# EAGLE design SNES_RGBAmp_1Chip03+ (EAGLE 7.5.0)
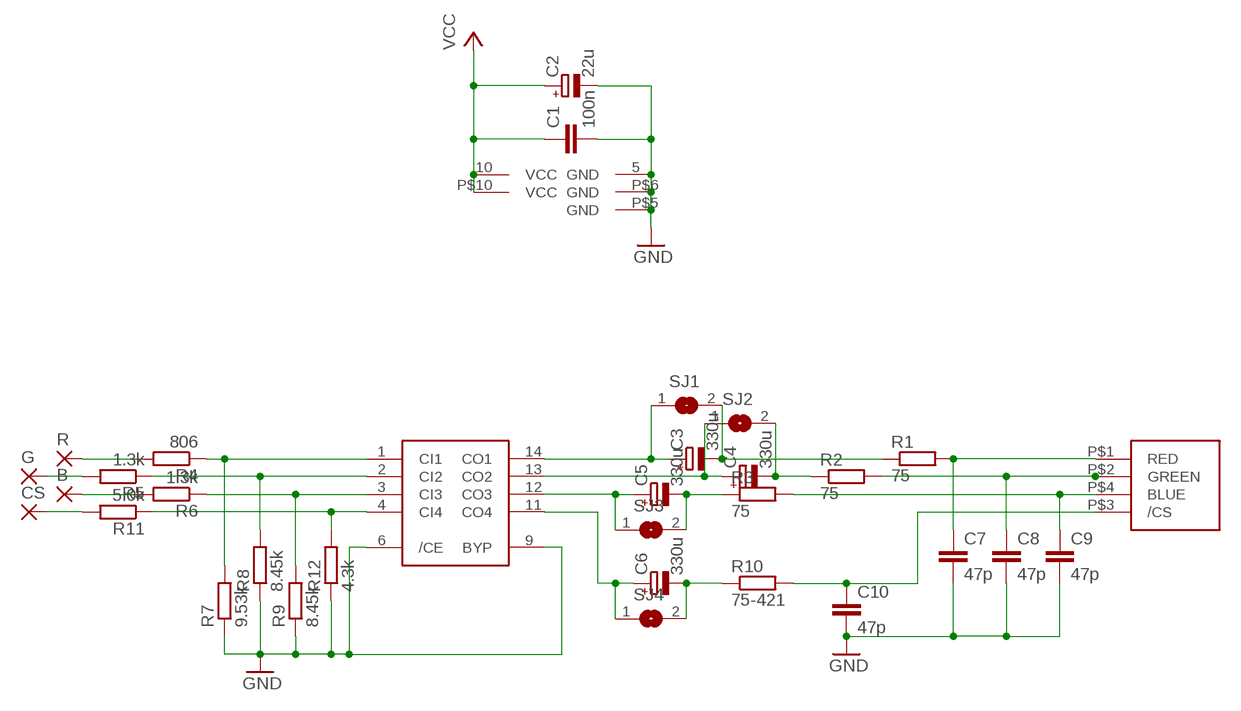
[diagram p0: schematic, sheet 1]

## Parts
B  SMD2  [SMD1,27-2,54]
C1  100n  C0805  [Z0805]
C2  22u  CPOL-EUSMCC  [SMC_C]
C3  330u  CPOL-EUSMCD  [SMC_D]
C4  330u  CPOL-EUSMCD  [SMC_D]
C5  330u  CPOL-EUSMCD  [SMC_D]
C6  330u  CPOL-EUSMCD  [SMC_D]
C7  47p  C0805  [Z0805]
C8  47p  C0805  [Z0805]
C9  47p  C0805  [Z0805]
C10  47p  C0805  [Z0805]
CS  SMD2  [SMD1,27-2,54]
G  SMD2  [SMD1,27-2,54]
R  SMD2  [SMD1,27-2,54]
R1  75  R0805  [Z0805]
R2  75  R0805  [Z0805]
R3  75  R0805  [Z0805]
R4  806  R0805  [Z0805]
R5  1.3k  R0805  [Z0805]
R6  1.3k  R0805  [Z0805]
R7  9.53k  R0805  [Z0805]
R8  8.45k  R0805  [Z0805]
R9  8.45k  R0805  [Z0805]
R10  75-421  R0805  [Z0805]
R11  5.0k  R0805  [Z0805]
R12  4.3k  R0805  [Z0805]
SJ1  SJ  [SJ]
SJ2  SJ  [SJ]
SJ3  SJ  [SJ]
SJ4  SJ  [SJ]
U$2  THS7374  [THS7374]
U$3  SNES_MULTIAV_RGBC_ONLY  [SNES_MULTIAV_RGBC_ONLY]

## Nets
GND: C1.2 C2.- C7.2 C8.2 C9.2 C10.2 R7.1 R8.1 R9.1 R12.1 U$2.5(GND) U$2.6(/CE) U$2.9(BYP) U$3.P$5(GND) U$3.P$6(GND)
N$1: R4.1 R7.2 U$2.1(CI1)
N$2: R5.1 R8.2 U$2.2(CI2)
N$4: C3.- R1.1 SJ1.2
N$5: C7.1 R1.2 U$3.P$1(RED)
N$6: C8.1 R2.2 U$3.P$2(GREEN)
N$7: C4.+ SJ2.1 U$2.13(CO2)
N$8: C5.- R3.1 SJ3.2
N$9: C9.1 R3.2 U$3.P$4(BLUE)
N$10: R11.1 R12.2 U$2.4(CI4)
N$11: C5.+ SJ3.1 U$2.12(CO3)
N$12: C3.+ SJ1.1 U$2.14(CO1)
N$13: C4.- R2.1 SJ2.2
N$14: R4.2 R.1(P)
N$15: G.1(P) R5.2
N$16: B.1(P) R6.2
N$17: CS.1(P) R11.2
N$18: C6.+ SJ4.1 U$2.11(CO4)
N$19: C6.- R10.1 SJ4.2
N$20: C10.1 R10.2 U$3.P$3(/CS)
R9: R6.1 R9.2 U$2.3(CI3)
VCC: C1.1 C2.+ U$2.10(VCC) U$3.P$10(VCC)

## Library data of the parts
B CS G R = wirepad:SMD2: SMD PAD
C1 C7-C10 = snescart:C0805
C2-C6 = rcl:CPOL-EU: POLARIZED CAPACITOR, European symbol
R1-R12 = snescart:R0805
SJ1-SJ4 = jumper:SJ: SMD solder JUMPER
U$2 = snes_div:THS7374
U$3 = snes_div:SNES_MULTIAV_RGBC_ONLY

## Board
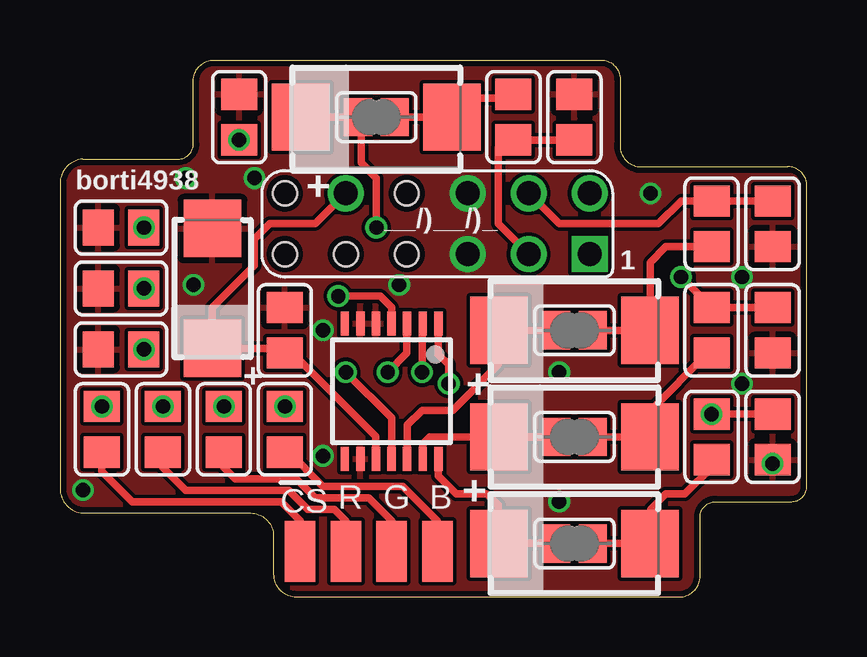
[diagram p1: board, top side]
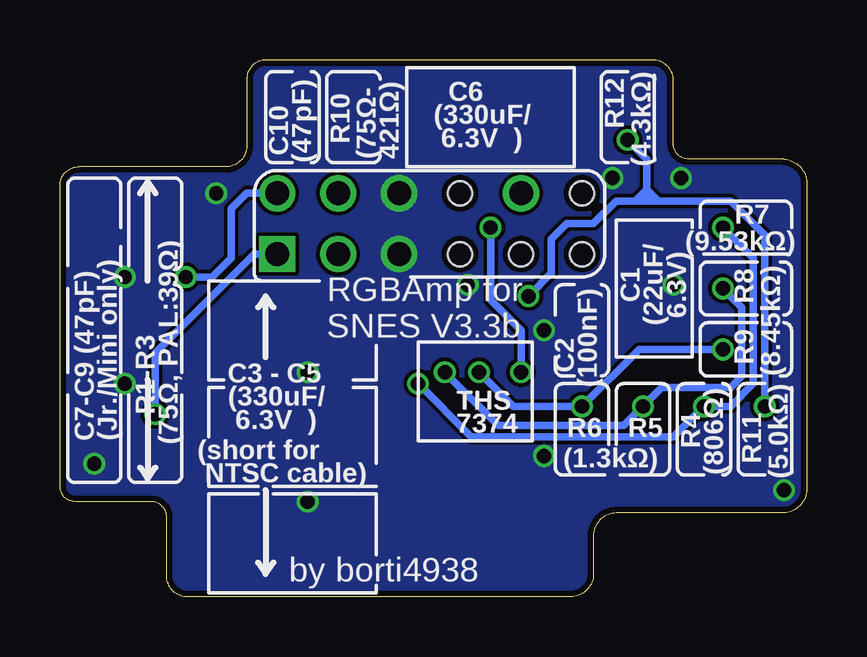
[diagram p2: board, bottom side, seen from below]

Size 31.12 x 22.39 mm. Coordinates in mm from the lower left corner, seen from the top.
Outline: 0.96,18.26 arc90 0,17.14 0,4.6 arc90 0.96,3.49 7.94,3.49 arc-90 8.89,2.54 8.89,0.95 arc90 9.85,0 25.88,0 arc90 26.67,0.95 26.67,3.33 arc-90 27.31,3.97 30.48,3.97 arc90 31.12,4.6 31.12,17.14 arc90 30.32,17.94 24.13,17.94 arc-90 23.34,18.89 23.34,21.59 arc90 22.55,22.38 6.51,22.38 arc90 5.56,21.59 5.56,18.89 arc-90 4.92,18.26 0.96,18.26
Copper layers (1*16): Top 0.035mm / dielectric 1.5mm / Bottom 0.035mm
Design rules "ITEADstudio_DRC": minimum track width 6mil, minimum drill 12mil, track to track 6mil, track to pad 6mil, pad to pad 6mil, via to via 6mil, smd to smd 0mil, copper to edge 10mil, drill to drill 10mil, minimum pad ring 10mil, minimum via ring 6mil, stop-mask expansion 2mil, vias tented up to drill 30mil, thermal gap 10mil

### Footprints (pad centres in the part's own frame; a part is rotated, then mirrored left to right if it is on the bottom)
SMD1,27-2,54 = smd 1.27 x 2.54: 1 0,0
Z0805 = smd 1.3 x 1.5: 1 -0.95,0; 2 0.95,0
SMC_C = smd 2.4 x 2.4: + -2.5,0; - 2.5,0
SMC_D = smd 2.4 x 2.8: + -3.15,0; - 3.15,0
SJ = smd 1.168 x 1.6: 1 -0.762,0; 2 0.762,0
THS7374 = smd 0.35 x 1: 1 -1.95,-2.825; 2 -1.3,-2.825; 3 -0.65,-2.825; 4 0,-2.825; 5 0.65,-2.825; 6 1.3,-2.825; 7 1.95,-2.825; 8 1.95,2.825; 9 1.3,2.825; 10 0.65,2.825; 11 0,2.825; 12 -0.65,2.825; 13 -1.3,2.825; 14 -1.95,2.825
SNES_MULTIAV_RGBC_ONLY = drill 1 square: P$1 6.35,-1.27 | drill 1: P$2 6.35,1.27; P$3 3.81,-1.27; P$4 3.81,1.27; P$5 1.27,-1.27; P$6 1.27,1.27; P$10 -3.81,1.27 | hole 1: -1.27,-1.27; -1.27,1.27; -3.81,-1.27; -6.35,-1.27; -6.35,1.27

### Placement (x,y rotation side)
B  15.72,1.91 0 top
C1  9.37,11.11 90 top
C2  6.35,12.86 90 top
C3  21.43,2.22 0 top
C4  21.43,6.67 0 top
C5  21.43,11.11 0 top
C6  13.18,20 0 top
C7  29.69,6.67 270 top
C8  29.69,11.11 270 top
C9  29.69,15.56 270 top
C10  21.43,20 90 top
CS  10,1.91 0 top
G  13.81,1.91 0 top
R  11.91,1.91 0 top
R1  27.15,6.67 90 top
R2  27.15,11.11 90 top
R3  27.15,15.56 90 top
R4  4.29,6.99 270 top
R5  6.83,6.99 270 top
R6  9.37,6.99 270 top
R7  2.54,15.4 0 top
R8  2.54,12.86 0 top
R9  2.54,10.32 0 top
R10  18.89,20 270 top
R11  1.75,6.99 270 top
R12  7.46,20 270 top
SJ1  21.43,2.22 0 top
SJ2  21.43,6.67 0 top
SJ3  21.43,11.11 0 top
SJ4  13.18,20 0 top
U$2  13.81,8.57 180 top
U$3  15.72,15.56 0 top

### Tracks (layer width: path | path; a pad name or v marks a point on that pad's centre or on a via)
GND  (via drill 0.6)
  other vias: 10.96,5.87 20.8,3.97 8.1,17.46 20.8,9.37 10.96,11.11 14.13,13.02 24.61,16.83 5.56,13.02 0.96,4.45 5.24,17.46 28.42,8.89 28.42,13.34 29.69,5.56
  pour Bottom: -0.79,25.08 34.77,25.08 34.77,-1.59 -0.79,-1.59
  pour Top (rank 2): -0.79,25.08 -0.79,-1.59 34.77,-1.59 34.77,25.08
  pour Bottom (no thermals): 15.72,18.73 18.26,18.73 18.26,13.02 15.72,13.02
  pour Top (no thermals): 15.72,18.73 18.26,18.73 18.26,13.02 15.72,13.02
N$1  (via drill 0.6)
  Top 0.305: R4.1 | v3.5,15.4 R7.2 | U$2.1 15.76,10.11 16.2,9.68 v16.2,8.89
  Bottom 0.305: v3.5,15.4 2.23,14.13 2.23,8.89 3.18,7.94 3.97,7.94 R4.1 5.56,6.67 13.97,6.67 v16.2,8.89
  other vias: 4.29,7.94
N$2  (via drill 0.6)
  Top 0.305: R8.2 v3.5,12.86 | R5.1 | U$2.2 15.08,11.43 v15.08,9.37
  Bottom 0.305: v3.5,12.86 2.7,12.06 2.7,9.21 3.18,8.73 6.04,8.73 R5.1 7.62,7.14 12.86,7.14 v15.08,9.37
  other vias: 6.83,7.94
N$4
  Top 0.305: SJ1.2 C3.- 24.58,3.15 24.61,3.18 24.61,3.65 25.24,4.29 26.04,4.29 27.15,5.4 R1.1
N$5  (via drill 0.6)
  Top 0.305: v27.15,7.62 C7.1
  Bottom 0.305: U$3.P$1 23.02,14.29 27.15,10.16 v27.15,7.62
N$6  (via drill 0.6)
  Top 0.305: v25.88,13.34 R2.2 C8.1
  Bottom 0.305: U$3.P$2 23.34,16.83 23.97,16.19 23.97,14.13 24.77,13.34 v25.88,13.34
N$7
  Top 0.305: SJ2.1 C4.+ 15.4,6.67 15.11,6.38 U$2.13
N$8
  Top 0.305: R3.1 25.24,14.6 24.58,13.95 C5.- SJ3.2
N$9
  Top 0.305: U$3.P$4 20.8,15.56 24.93,15.56 25.88,16.51 R3.2 C9.1
N$10  (via drill 0.6)
  Top 0.305: R11.1 | 7.47,19.21 R12.2 | v11.59,12.54 13.34,12.54 13.81,12.06 U$2.4
  Bottom 0.305: R11.1 1.75,15.08 3.18,16.51 6.19,16.51 | v11.59,12.54 10.64,13.49 10.64,14.92 10,15.56 8.89,15.56 7.94,16.51 7.15,16.51 | 6.19,16.51 6.67,16.99 7.15,16.51 | 7.15,16.51 6.51,16.51 | 6.19,16.51 6.51,16.51 | 6.51,16.51 6.67,16.67 6.67,18.26 R12.2
  other vias: 1.75,7.94 7.46,19.05
N$11
  Top 0.305: SJ3.1 C5.+ 18.26,11.09 18.26,9.68 16.35,7.78 15.08,7.78 14.46,7.16 U$2.12
N$12
  Top 0.305: SJ1.1 C3.+ 18.26,2.25 18.26,3.81 17.78,4.29 16.51,4.29 15.76,5.03 U$2.14
N$13
  Top 0.305: R2.1 26.99,10.16 24.61,7.78 24.61,6.69 C4.- SJ2.2
N$14
  Top 0.305: R4.2 4.29,5.4 5.24,4.44 9.53,4.44 10.32,3.65 11.43,3.65 11.91,3.17 R.1
N$15
  Top 0.305: G.1 13.81,3.17 12.86,4.13 10.64,4.13 9.85,4.92 7.31,4.92 6.83,5.4 R5.2
N$16
  Top 0.305: B.1 15.72,3.17 14.29,4.6 10.96,4.6 9.53,6.03 R6.2
N$17
  Top 0.305: R11.2 1.75,5.24 3.02,3.97 9.21,3.97 10,3.17 CS.1
N$18  (via drill 0.6)
  Top 0.305: U$2.11 13.81,7.46 v11.91,9.37 | v13.18,15.4 13.18,17.46 12.54,18.1 12.54,19.88 SJ4.1 C6.+
  Bottom 0.305: v11.91,9.37 11.91,11.11 13.18,12.38 v13.18,15.4
N$19
  Top 0.305: SJ4.2 C6.- 16.35,20.03 16.35,20.64 16.51,20.8 18.89,20.8 R10.1
N$20
  Top 0.305: C10.1 R10.2 18.26,18.73 18.26,15.56 U$3.P$3
R9  (via drill 0.6)
  Top 0.305: 3.02,10.16 3.33,10.48 R9.2 v3.5,10.32 | R6.1 | v13.66,9.37 14.45,10.16 14.45,11.38 U$2.3
  Bottom 0.305: v3.5,10.32 6.99,10.32 R6.1 12.23,7.94 v13.66,9.37
  other vias: 9.37,7.94
VCC
  Top 0.305: U$3.P$10 10.64,15.56 8.73,15.56 8.1,14.92 8.1,13.81 6.35,12.06 C2.+ 9.17,10.36 | U$2.10 13.16,6.68 10,9.84 9.69,9.84 C1.1
  Top 0.356: 9.17,10.36 C1.1
  Top 0.406: 9.37,10.48 C1.1 9.37,9.84 | 6.35,9.68 C2.+

### Text on the board
tPlace: + | borti4938 | __/)__/)_ | 1 | + | + | +
bPlace: RGBAmp for / SNES V3.3b | THS / 7374 | by borti4938
bNames: R12 | C6 / (330uF/ / 6.3V ) | R10 | (4.3kΩ) | (75Ω- / 421Ω) | C10 / (47pF) | R7 | (9.53kΩ) | C1 / (22uF/ / 6.3V) | R8 | R9 | (8.45kΩ) | C2 / (100nF) | R5 | R6 | C3 - C5 / (330uF/ / 6.3V ) | R1-R3 / (75Ω, PAL:39Ω) | C7-C9 (47pF) / (Jr./Mini only) | R11 | R4 | (1.3kΩ) | (5.0kΩ) | (806Ω) | (short for / NTSC cable)